# EAGLE design OpAmpBreakout-fragmentB (EAGLE 6.4)
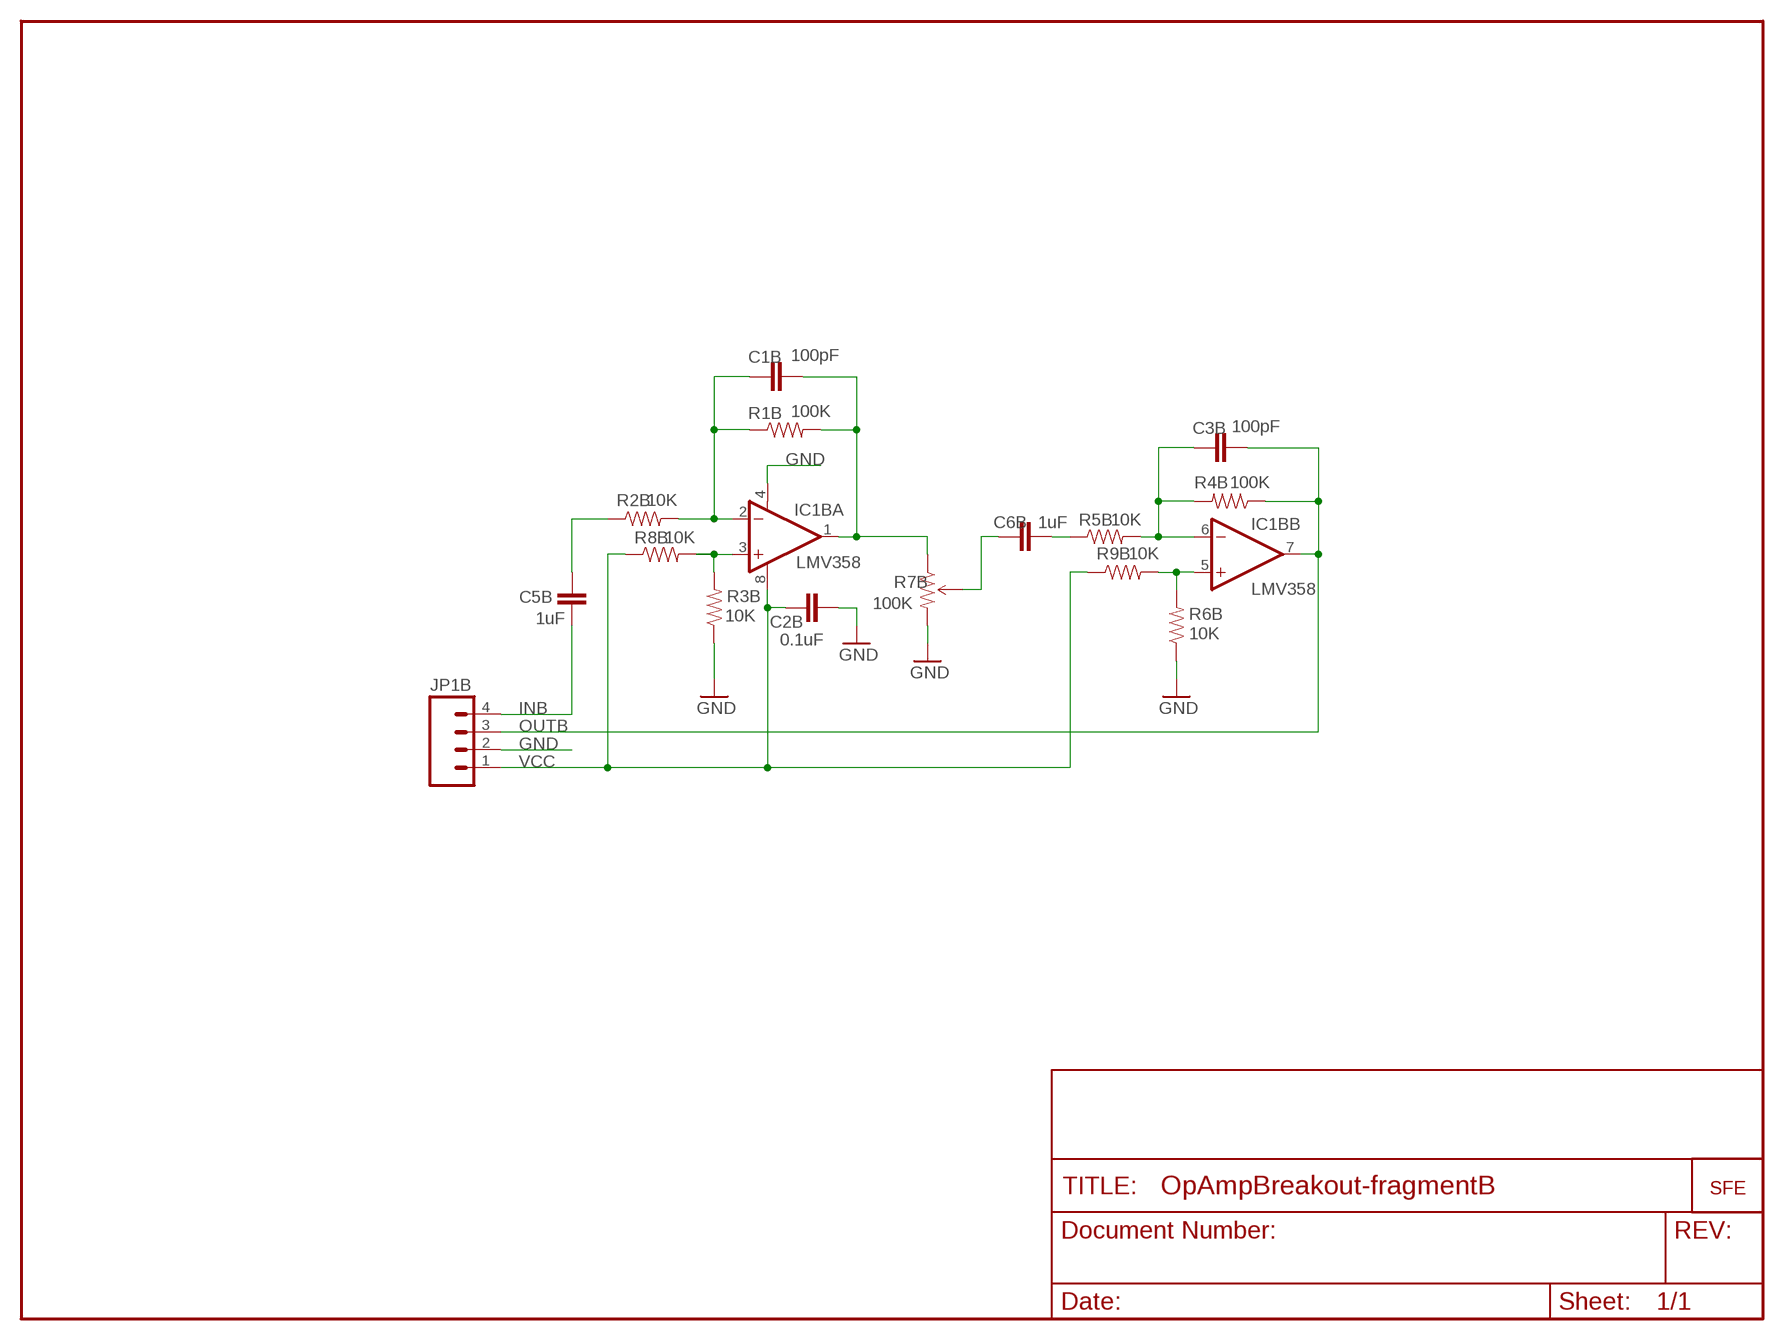
[diagram p0: schematic, sheet 1]

## Parts
C1B  100pF  CAP0402  [C0402]
C2B  0.1uF  CAP0402  [C0402]
C3B  100pF  CAP0402  [C0402]
C5B  1uF  CAP0402  [C0402]
C6B  1uF  CAP0402  [C0402]
IC1B  LMV358  OPAMP-DUALU  [SO08]
JP1B  M04PTH  [1X04]
R1B  100K  RESISTOR0402  [C0402]
R2B  10K  RESISTOR0402  [C0402]
R3B  10K  RESISTOR0402  [C0402]
R4B  100K  RESISTOR0402  [C0402]
R5B  10K  RESISTOR0402  [C0402]
R6B  10K  RESISTOR0402  [C0402]
R7B  100K  TRIMPOTSMD  [TRIMPOT-3MM]
R8B  10K  RESISTOR0402  [C0402]
R9B  10K  RESISTOR0402  [C0402]
U$3B  LOGO-SFENEW  [SFE-NEW-WEBLOGO]

## Nets
GND: C2B.2 IC1B.4(A:V-) JP1B.2 R3B.1 R6B.1 R7B.3(CW)
IN1B: C5B.2 R2B.1
INB: C5B.1 JP1B.4
N$1B: IC1B.5(B:+IN) R6B.2 R9B.2
N$2B: C1B.1 IC1B.2(A:-IN) R1B.1 R2B.2
N$3B: IC1B.3(A:+IN) R3B.2 R8B.2
N$4B: C6B.1 R5B.1
N$5B: C6B.2 R7B.2(WIPER)
N$7B: C3B.1 IC1B.6(B:-IN) R4B.2 R5B.2
OUT1B: C1B.2 IC1B.1(A:OUT) R1B.2 R7B.1(CCW)
OUTB: C3B.2 IC1B.7(B:OUT) JP1B.3 R4B.1
VCC: C2B.1 IC1B.8(A:V+) JP1B.1 R8B.1 R9B.1

## Library data of the parts
C1B C2B C3B C5B C6B = SparkFun:CAP: Capacitor Standard 0603 ceramic capacitor, and 0.1" leaded capacitor.
IC1B = SparkFun:OPAMP-DUAL: Operational Amplifier
JP1B = SparkFun:M04: Header 4 Standard 4-pin 0.1" header. Use with straight break away headers (SKU : PRT-00116), right angle break away headers (PRT-00553), swiss pins (PRT-00743), machine pins (PRT-00117), and female headers (PRT-00115). Molex polarized connector foot print use with SKU : PRT-08231 with associated crimp pins and housings.
R1B R2B R3B R4B R5B R6B = SparkFun:RESISTOR: Resistor Basic schematic elements and footprints for 0603, 1206, and PTH 1/10th watt (small) resistors.
R7B = SparkFun:TRIMPOT
R8B R9B = SparkFun-DC:RESISTOR: Resistor Basic schematic elements and footprints for 0603, 1206, and PTH 1/10th watt (small) resistors.
U$3B = SparkFun:LOGO-SFE: Spark Fun Electronics PCB Logo This is the standard Spark Fun Electronics PCB logo.

## Board
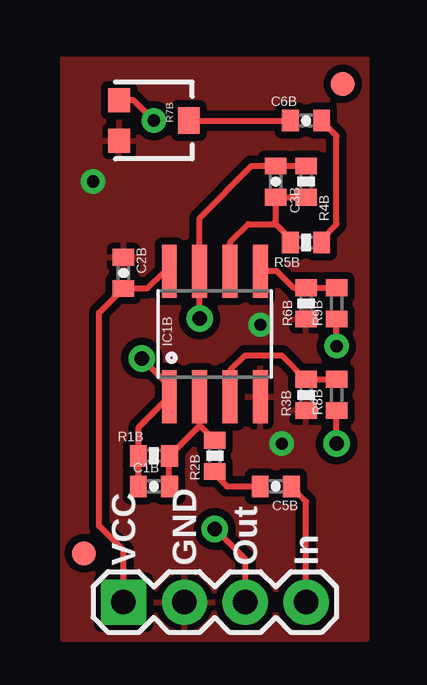
[diagram p1: board, top side]
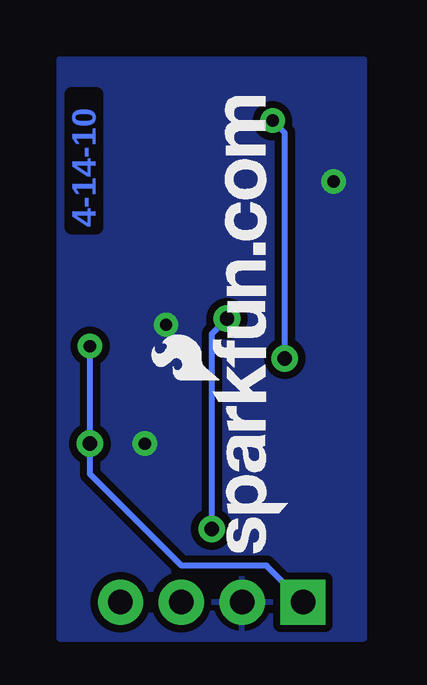
[diagram p2: board, bottom side, seen from below]

No outline drawn. Coordinates in mm, seen from the top.
Copper layers (1*16): Top 0.035mm / dielectric 1.5mm / Bottom 0.035mm
Design rules "SparkFun": minimum track width 8mil, minimum drill 20mil, track to track 8mil, track to pad 8mil, pad to pad 8mil, via to via 8mil, smd to smd 8mil, copper to edge 10mil, drill to drill 8mil, minimum pad ring 12mil, minimum via ring 10mil, stop-mask expansion 4mil, vias tented up to drill 25mil, thermal gap 10mil

### Footprints (pad centres in the part's own frame; a part is rotated, then mirrored left to right if it is on the bottom)
0402-CAP = smd 0.7 x 0.9: 1 -0.65,0; 2 0.65,0
FIDUCIAL-1X2 = smd 1 x 1: 1 0,0
SO08 = smd 0.61 x 2.21: 1 -1.905,-2.616; 2 -0.635,-2.616; 3 0.635,-2.616; 4 1.905,-2.616; 5 1.905,2.616; 6 0.635,2.616; 7 -0.635,2.616; 8 -1.905,2.616
1X04 = drill 1.016 pad 1.88 square: 1 0,0 | drill 1.016 pad 1.88: 2 2.54,0; 3 5.08,0; 4 7.62,0
0402-RES = smd 0.7 x 0.9: 1 -0.65,0; 2 0.65,0
TRIMPOT-3MM = smd 1 x 0.9: 1 -0.85,-1.45; 3 0.85,-1.45 | smd 1.1 x 0.9: 2 0,1.45
C0402 = smd 0.7 x 0.9: 1 -0.65,0; 2 0.65,0

### Placement (x,y rotation side)
C1B  100pF  [0402-CAP]  3.81,6.35 180 top
C2B  0.1uF  [0402-CAP]  2.54,15.24 90 top
C3B  100pF  [0402-CAP]  8.89,19.05 90 top
C5B  1uF  [0402-CAP]  8.89,6.35 180 top
C6B  1uF  [0402-CAP]  10.16,21.59 180 top
E$1B  [FIDUCIAL-1X2]  11.68,23.11 0 top
E$2B  [FIDUCIAL-1X2]  0.89,3.56 0 top
IC1B  6.35,12.7 0 top
JP1B  2.54,1.52 0 top
R1B  100K  [0402-RES]  3.81,7.62 180 top
R2B  10K  [0402-RES]  6.35,7.62 90 top
R3B  10K  [0402-RES]  10.16,10.16 90 top
R4B  100K  [0402-RES]  10.16,19.05 270 top
R5B  10K  [0402-RES]  10.16,16.51 180 top
R6B  10K  [0402-RES]  10.16,13.97 90 top
R7B  3.81,21.59 270 top
R8B  11.43,10.16 90 top
R9B  11.43,13.97 90 top
U$3B  3.17,3.57 90 bottom

### Tracks (layer width: path | path; a pad name or v marks a point on that pad's centre or on a via)
GND  (via drill 0.51)
  other vias: 1.27,19.05 8.26,13.08 9.14,8.13
  pour Top (isolate 0.305): 0,0 12.7,0 12.7,24.13 0,24.13
  pour Bottom (isolate 0.305): 0,0 12.7,0 12.7,24.13 0,24.13
  pour Bottom (isolate 0.305): 0,0 0,24.13 12.7,24.13 12.7,0
IN1B
  Top 0.254: R2B.1 6.35,6.86 6.86,6.35 C5B.2
INB
  Top 0.254: C5B.1 9.53,6.35 10.16,5.71 JP1B.4
N$1B
  Top 0.254: R6B.2 10.05,14.62 10.03,14.61 | R6B.2 R9B.2 | IC1B.5 8.94,15.32 9.65,14.61 9.91,14.61 10.03,14.73 10.14,14.62 R6B.2
N$2B
  Top 0.254: 6.06,8.17 R2B.2 6.35,8.26 5.71,8.89 | 5.71,8.89 IC1B.2 | 5.71,8.89 5.71,8.88 R1B.1 4.45,7.62 4.45,6.37 C1B.1
N$3B
  Top 0.254: R3B.2 10.05,10.81 10.03,10.79 | R3B.2 R8B.2 | IC1B.3 6.99,11.18 7.62,11.81 9.14,11.81 10.16,10.79 R3B.2
N$4B
  Top 0.254: R5B.1 10.81,16.65 11.43,17.27 11.43,20.95 10.79,21.59 C6B.1
N$5B
  Top 0.254: R7B.2 C6B.2
N$7B
  Top 0.254: IC1B.6 6.99,16.51 7.75,17.27 8.76,17.27 | R5B.2 9.51,16.62 9.53,16.64 8.89,17.27 8.76,17.27 | 8.76,17.27 8.89,17.4 C3B.1 10.14,18.4 10.16,18.41 R4B.2
OUT1B  (via drill 0.51, 0.6)
  Top 0.254: C1B.2 3.17,6.35 3.17,7.61 R1B.2 3.17,7.62 3.17,8.81 IC1B.1 4.45,10.54 v3.3,11.68 | v3.81,21.59 2.96,22.44 R7B.1
  Bottom 0.254: v3.3,11.68 3.3,21.08 v3.81,21.59
OUTB  (via drill 0.6)
  Top 0.254: R4B.1 8.9,19.7 8.89,19.68 C3B.2 7.89,19.7 5.71,17.53 IC1B.7 v5.71,13.34 | JP1B.3 7.62,3.3 v6.35,4.57
  Bottom 0.254: v6.35,4.57 6.35,12.7 v5.71,13.34
VCC  (via drill 0.51, 0.6)
  Top 0.254: 11.43,13.21 11.36,13.21 R9B.1 | v11.43,8.13 11.43,9.65 11.36,9.65 R8B.1 | JP1B.1 2.54,3.68 1.52,4.7 1.52,13.59 2.54,14.61 | IC1B.8 4.27,15.32 3.56,14.61 2.54,14.61 | 2.54,14.61 C2B.1 | R9B.1 11.43,13.34 | v11.43,12.19 R9B.1
  Bottom 0.254: JP1B.1 4.06,3.05 7.62,3.05 11.43,6.86 v11.43,8.13 v11.43,12.19

### Text on the board
Bottom: 4-14-10
tPlace: VCC | GND | Out | In
tValues: 100K trimpot | LMV358